# Altium schematic sheet AFE.SchDoc
size A4; SheetNumber: 3; SheetTotal: 3
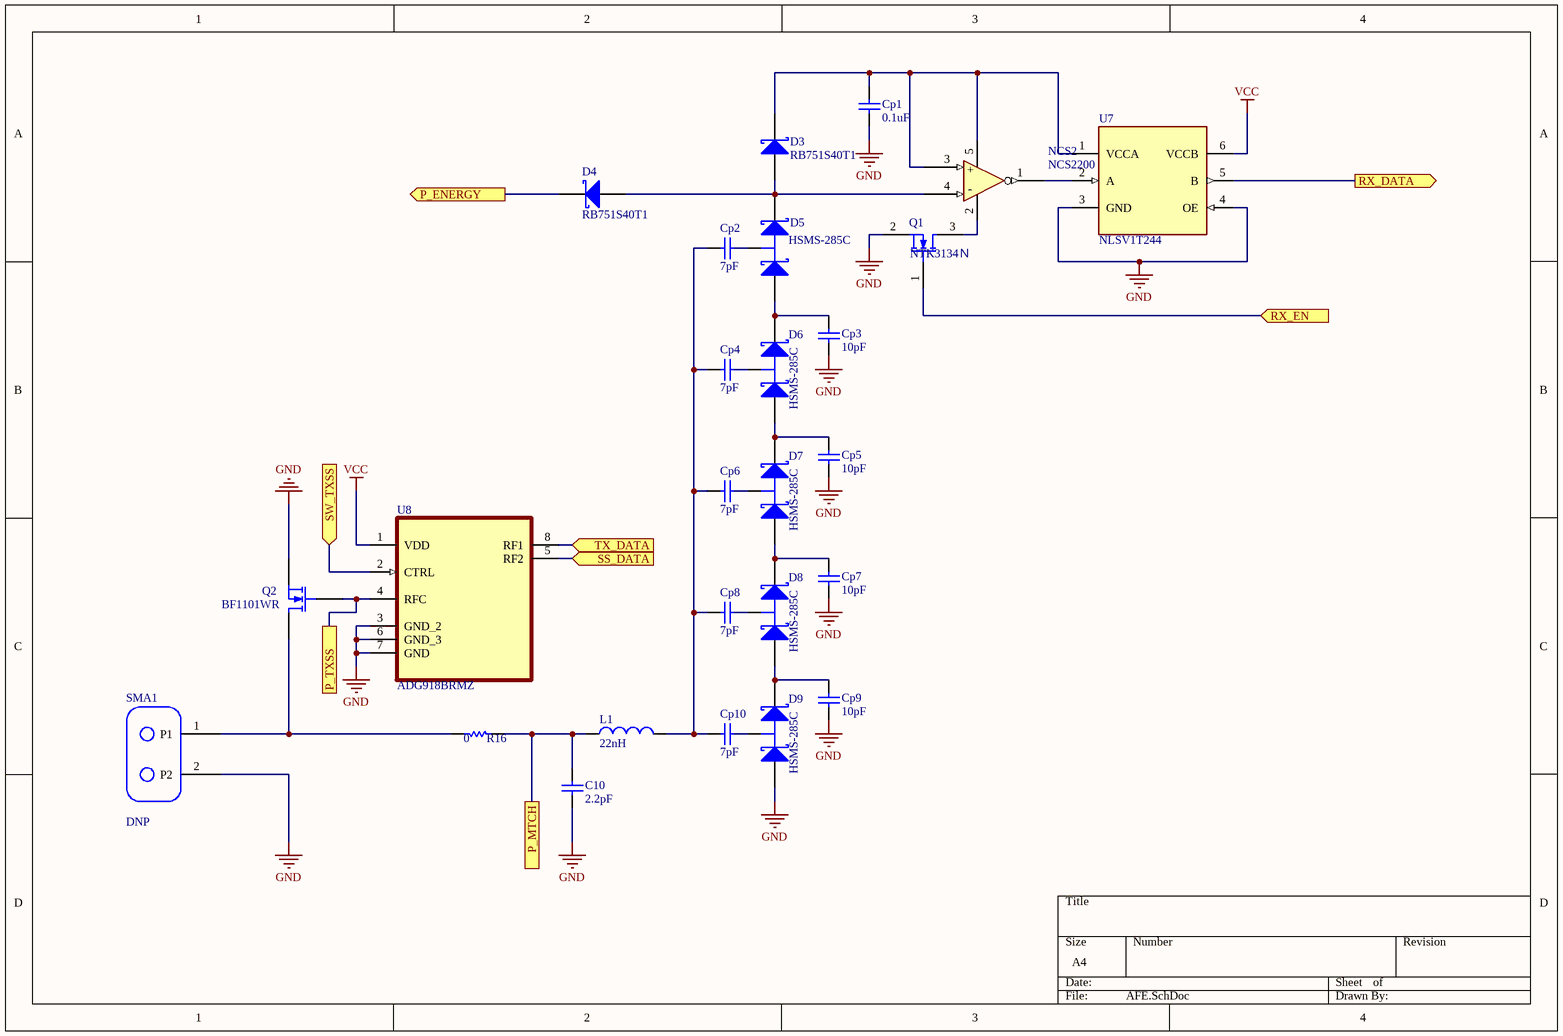
[diagram p0: AFE.SchDoc]

## Parts
C10  value 2.2pF  [0805]
Cp1  value 0.1uF  [0402]
Cp2  value 7pF  [0402]
Cp3  value 10pF  [0402]
Cp4  value 7pF  [0402]
Cp5  value 10pF  [0402]
Cp6  value 7pF  [0402]
Cp7  value 10pF  [0402]
Cp8  value 7pF  [0402]
Cp9  value 10pF  [0402]
Cp10  value 7pF  [0402]
D3  RB751S40T1  [SOD-523]
D4  RB751S40T1  [SOD-523]
D5  HSMS-285C  [SOT-323, HSMS-285C]
D6  HSMS-285C  [SOT-323, HSMS-285C]
D7  HSMS-285C  [SOT-323, HSMS-285C]
D8  HSMS-285C  [SOT-323, HSMS-285C]
D9  HSMS-285C  [SOT-323, HSMS-285C]
L1  value 22nH  [0805]
NCS2  NCS2200  [SC70-5]
Q1  NTK3134Ｎ  [SOT40P120X55-3N]
Q2  BF1101WR  [SOT343R]
R16  value 0  [0805]
SMA1  (no value)  [SMA - Hole - 2 Pin]
U7  NLSV1T244  [UDFN6]
U8  ADG918BRMZ  [SOP65P490X110-8N]

## Ports
P_ENERGY (out), P_MTCH, P_TXSS, RX_DATA (out), RX_EN (in), SS_DATA (in), SW_TXSS (in), TX_DATA (in)

## Nets
GND: C10.1 Cp1.2 Cp3.2 Cp5.2 Cp7.2 Cp9.2 D9.1(A) Q1.2(S) Q2.1(S) SMA1.2(P2) U7.3(GND) U7.4(OE) U8.3(GND_2) U8.6(GND_3) U8.7(GND)
VCC: U7.6(VCCB) U8.1(VDD)
P_ENERGY: D4.1(C) ; port P_ENERGY
P_MTCH: C10.2 L1.1 R16.1 ; port P_MTCH
P_TXSS: Q2.3(G) U8.4(RFC) ; port P_TXSS
RX_DATA: U7.5(B) ; port RX_DATA
RX_EN: Q1.1(G) ; port RX_EN
SS_DATA: U8.5(RF2) ; port SS_DATA
SW_TXSS: U8.2(CTRL) ; port SW_TXSS
TX_DATA: U8.8(RF1) ; port TX_DATA
NetCp1_1: Cp1.1 D3.1(C) NCS2.3(IN+) NCS2.5(VDD) U7.1(VCCA)
NetCp2_1: Cp2.1 D5.3(C)
NetCp2_2: Cp2.2 Cp4.2 Cp6.2 Cp8.2 Cp10.2 L1.2
NetCp3_1: Cp3.1 D5.1(A) D6.2(K)
NetCp4_1: Cp4.1 D6.3(C)
NetCp5_1: Cp5.1 D6.1(A) D7.2(K)
NetCp6_1: Cp6.1 D7.3(C)
NetCp7_1: Cp7.1 D7.1(A) D8.2(K)
NetCp8_1: Cp8.1 D8.3(C)
NetCp9_1: Cp9.1 D8.1(A) D9.2(K)
NetCp10_1: Cp10.1 D9.3(C)
NetD3_2: D3.2(A) D4.2(A) D5.2(K) NCS2.4(In-)
NetNCS2_1: NCS2.1(OUT) U7.2(A)
NetNCS2_2: NCS2.2(GND) Q1.3(D)
NetQ2_2: Q2.2(D) R16.2 SMA1.1(P1)

## Notes on the sheet
- (in symbol NCS2200) +; -

## Library data of the parts
C10 = Cap: Ceramic Capacitor (Surface Mount); Manufacturer: Johanson; Manufacturer Part Number: 500R07S5R6CV4T; Digi-Key Part Number: 712-1289-1-ND; Note: *; Rating: *
Cp1-Cp10 = Cap: Ceramic Capacitor (Surface Mount); Manufacturer: Johanson; Manufacturer Part Number: 500R07S100JV4T; Digi-Key Part Number: 712-1253-1-ND; Note: *; Rating: *
D3 D4 = RB751S40T1: Schottky Diode; Published: 8-Jun-2000; LatestRevisionDate: 17-Jul-2002; LatestRevisionNote: Re-released for DXP Platform.; PackageReference: SMB; Publisher: Altium Limited; Code_JEDEC: DO-214-AA
D5-D9 = HSMS-285C: Agilent Schottky Diode, Two in Series, Small Package SOT-323; Manufacturer: Avago Technologies US Inc.; Manufacturer Part Number: HSMS-285C-BLKG; Note: *; Digi-Key Part Number: 516-2558-ND; Rating: *; Value: *
L1 = Ind: Inductor (Surface Mount); Manufacturer: Coilcraft (http://www.coilcraft.com/0402cs.cfm); Manufacturer Part Number: 0402CS-16NX_LU; Digi-Key Part Number: N/A; Rating: *; Note: *
NCS2 = NCS2200: Comparator: On Semi 10uA Comparator; Manufacturer: ON Semiconductor; Manufacturer Part Number: NCS2200SQ2T2G; Digi-Key Part Number: NCS2200SQ2T2GOSTR-ND; Rating: *; Value: *; Note: *
Q2 = BF1101WR: N-Channel Dual-Gate Mos-Fets MOSFET, SOT343R; Manufacturer Part Number: BF1101WR,115; Manufacturer: NXP Semiconductors; Digi-Key Part Number: 568-6140-1-ND; Rating: *; Value: *; Note: *
R16 = Res: Chip Resistor (Surface Mount); Manufacturer: Panasonic; Manufacturer Part Number: ERJ-2RKF4702X; Digi-Key Part Number: P47.0KLCT-ND; Rating: *; Note: *
SMA1 = SMA - Hole - 2 Pin: Two pin SMA connector wisp; Note: This part is used to attach the antennae to WISP in the layout; DNP: DNP
U7 = NLSV1T244: Level Shifter: 1-Bit Dual-Supply Non-Inverting Level Translator; Manufacturer Part Number: NLSV1T244MUTBG; Manufacturer: ON Semiconductor; Digi-Key Part Number: NLSV1T244MUTBG-ND; Rating: *; Value: *; Note: *
U8 = ADG918BRMZ: RF Switch Single Pole 0 MHz to 4GHz 34dB 8-Pin MSOP; MF: Analog Devices; Value: *; SnapEDA_Link: https://www.snapeda.com/parts/ADG918BRMZ/Analog%20Devices%20Inc./view-part/239205/?ref=snap; Digi-Key_Part_Number: ADG918BRMZ-ND; Package: MSOP-8 Analog Devices; Digi-Key_Purchase_URL: https://www.digikey.ru/product-detail/en/analog-devices-inc/ADG918BRMZ/ADG918BRMZ-ND/820128?utm_source=snapeda&utm_medium=aggregator&utm_campaign=symbol; MP: ADG918BRMZ